# EAGLE design untitled (EAGLE 9.6.2)
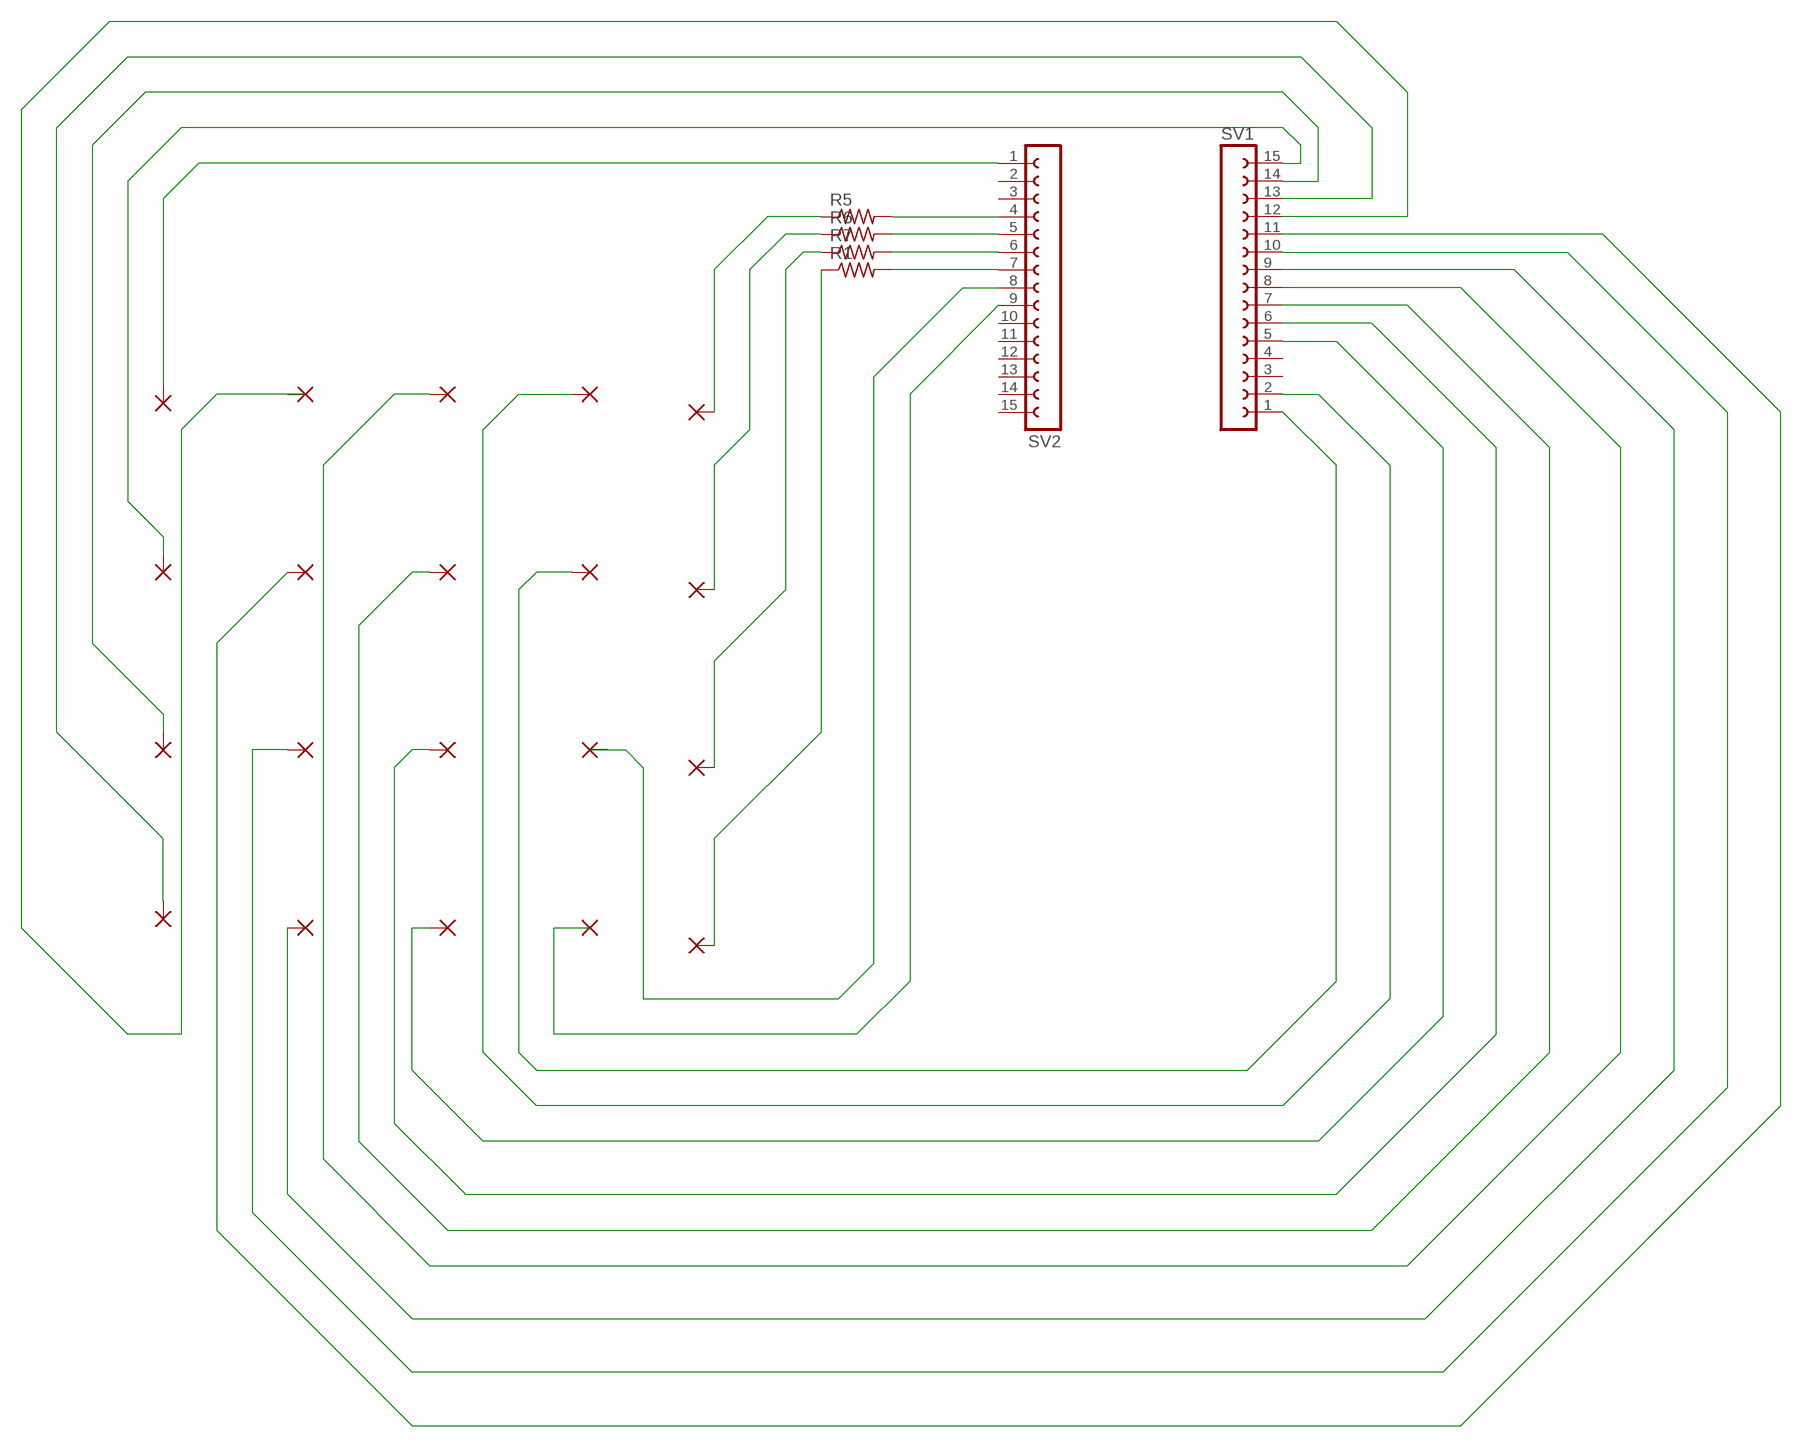
[diagram p0: schematic, sheet 1]

## Parts
PAD1  1,6/0,8  [1,6/0,8]
PAD2  1,6/0,8  [1,6/0,8]
PAD3  1,6/0,8  [1,6/0,8]
PAD4  1,6/0,8  [1,6/0,8]
PAD5  1,6/0,8  [1,6/0,8]
PAD6  1,6/0,8  [1,6/0,8]
PAD7  1,6/0,8  [1,6/0,8]
PAD8  1,6/0,8  [1,6/0,8]
PAD9  1,6/0,8  [1,6/0,8]
PAD10  1,6/0,8  [1,6/0,8]
PAD11  1,6/0,8  [1,6/0,8]
PAD12  1,6/0,8  [1,6/0,8]
PAD13  1,6/0,8  [1,6/0,8]
PAD14  1,6/0,8  [1,6/0,8]
PAD15  1,6/0,8  [1,6/0,8]
PAD16  1,6/0,8  [1,6/0,8]
PAD17  1,6/0,8  [1,6/0,8]
PAD18  1,6/0,8  [1,6/0,8]
PAD19  1,6/0,8  [1,6/0,8]
PAD20  1,6/0,8  [1,6/0,8]
R1  FLIPFLOP-RES  [0805-THM]
R5  FLIPFLOP-RES  [0805-THM]
R6  FLIPFLOP-RES  [0805-THM]
R7  FLIPFLOP-RES  [0805-THM]
SV1  FE15-1  [FE15]
SV2  FE15-1  [FE15]

## Nets
N$1: PAD17.1(P) SV2.1
N$2: PAD19.1(P) SV1.14
N$3: PAD18.1(P) SV1.15
N$4: PAD20.1(P) SV1.13
N$5: PAD16.1(P) SV1.12
N$6: R5.2 SV2.4
N$7: R6.2 SV2.5
N$8: R7.2 SV2.6
N$9: R1.2 SV2.7
N$10: PAD6.1(P) SV1.1
N$11: PAD7.1(P) SV2.8
N$12: PAD8.1(P) SV2.9
N$13: PAD5.1(P) SV1.2
N$14: PAD12.1(P) SV1.5
N$15: PAD9.1(P) SV1.8
N$16: PAD11.1(P) SV1.6
N$17: PAD10.1(P) SV1.7
N$18: PAD15.1(P) SV1.9
N$19: PAD14.1(P) SV1.10
N$20: PAD1.1(P) R5.1
N$21: PAD13.1(P) SV1.11
N$22: PAD2.1(P) R6.1
N$23: PAD3.1(P) R7.1
N$24: PAD4.1(P) R1.1
Unconnected: SV1.3 SV1.4 SV2.2 SV2.3 SV2.10 SV2.11 SV2.12 SV2.13 SV2.14 SV2.15

## Library data of the parts
PAD1-PAD20 = wirepad:1,6/0,8: THROUGH-HOLE PAD
R1 R5-R7 = adafruit:FLIPFLOP-RES: Flip Flop resistor An 0805 resistor inside a standard 1/4W 5% resistor. Makes for easy mods
SV1 SV2 = con-lsta:FE15-1: FEMALE HEADER; OC_FARNELL: unknown; OC_NEWARK: unknown

## Board
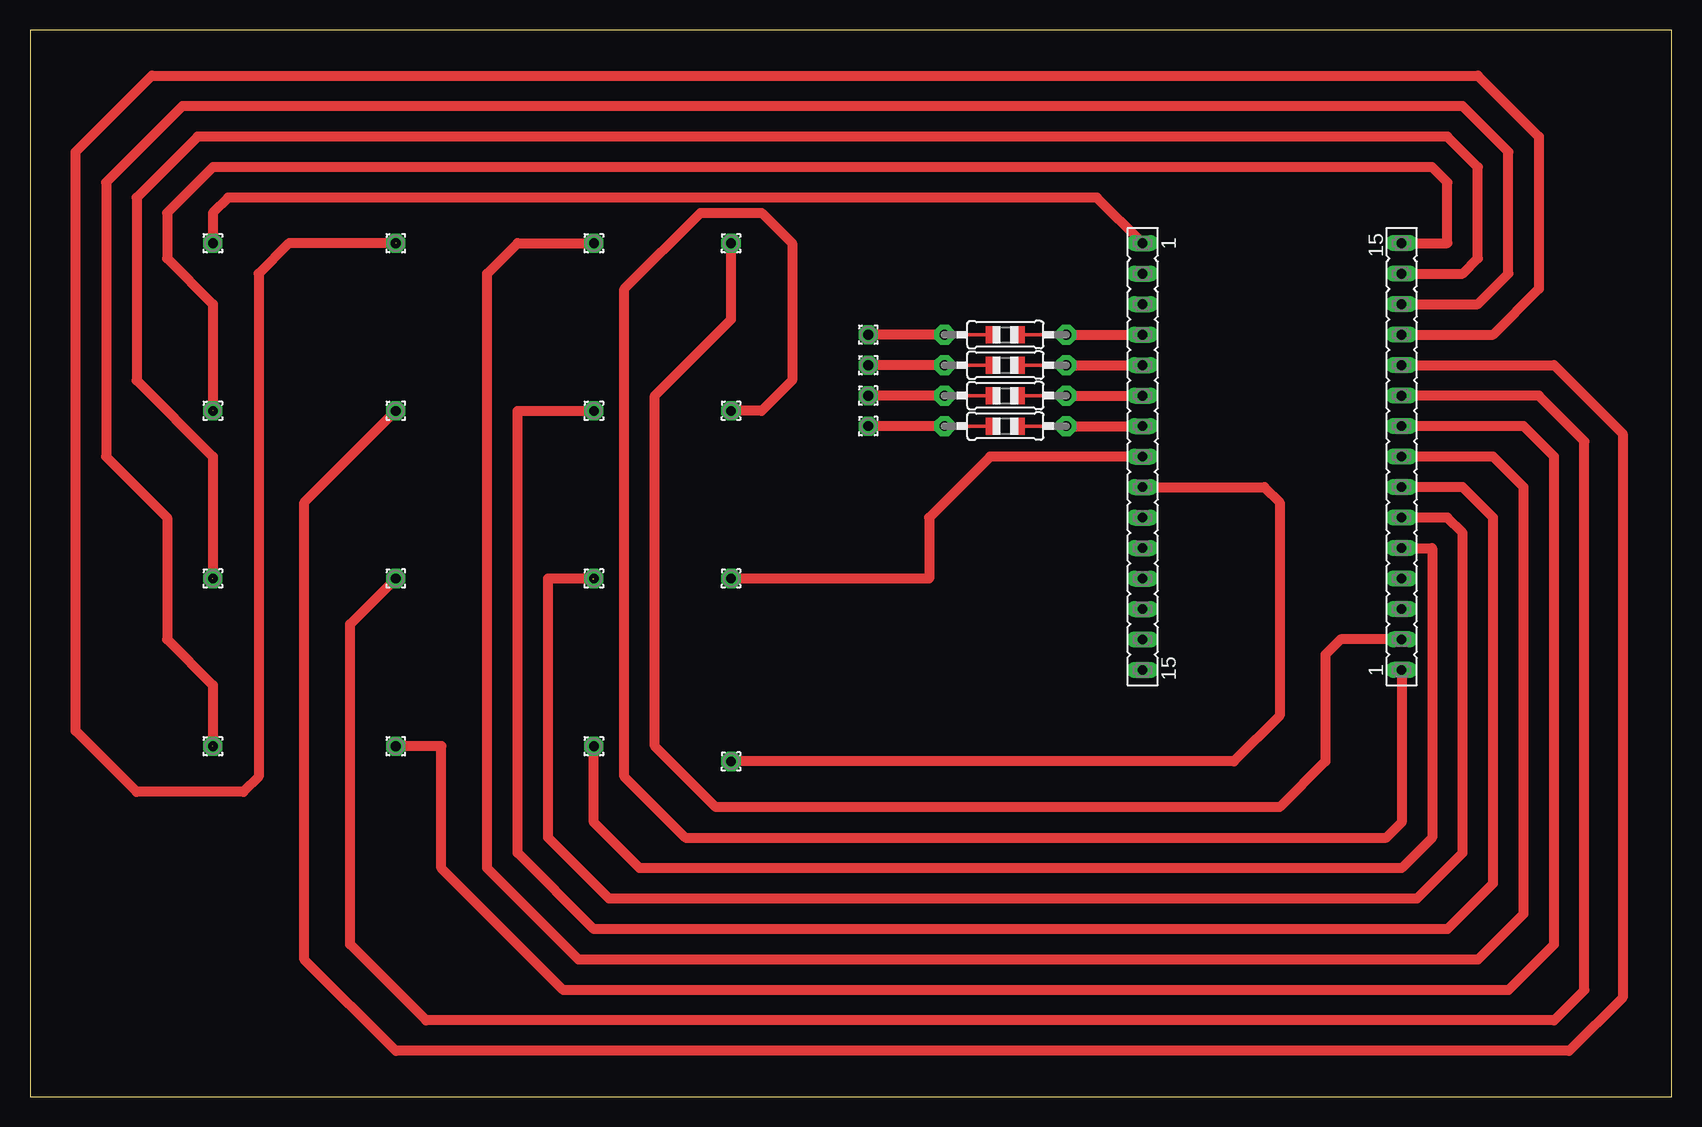
[diagram p1: board, top side]

Size 136.83 x 88.89 mm. Coordinates in mm from the lower left corner, seen from the top.
Outline: 0,0 136.83,0 136.83,88.89 0,88.89 0,0
Copper layers (1*16): Top 0.035mm / dielectric 1.5mm / Bottom 0.035mm
Design rules "default": minimum track width 6mil, minimum drill 0.35mm, track to track 6mil, track to pad 6mil, pad to pad 6mil, via to via 6mil, smd to smd 6mil, copper to edge 40mil, drill to drill 6mil, minimum pad ring 10mil, minimum via ring 8mil, stop-mask expansion 4mil, vias tented up to drill 0mil, thermal gap 10mil

### Footprints (pad centres in the part's own frame; a part is rotated, then mirrored left to right if it is on the bottom)
1,6/0,8 = drill 0.813 pad 1.6 octagon: 1 0,0
0805-THM = drill 0.813 pad 1.676 octagon: 1 -5.08,0; 2 5.08,0
FE15 = drill 0.813 long: 1 -17.78,0; 2 -15.24,0; 3 -12.7,0; 4 -10.16,0; 5 -7.62,0; 6 -5.08,0; 7 -2.54,0; 8 0,0; 9 2.54,0; 10 5.08,0; 11 7.62,0; 12 10.16,0; 13 12.7,0; 14 15.24,0; 15 17.78,0

### Placement (x,y rotation side)
PAD1  69.85,63.5 0 top
PAD2  69.85,60.96 0 top
PAD3  69.85,58.42 0 top
PAD4  69.85,55.88 0 top
PAD5  58.42,71.12 0 top
PAD6  58.42,57.15 0 top
PAD7  58.42,43.18 0 top
PAD8  58.42,27.94 0 top
PAD9  46.99,71.12 0 top
PAD10  46.99,57.15 0 top
PAD11  46.99,43.18 0 top
PAD12  46.99,29.21 0 top
PAD13  30.48,57.15 0 top
PAD14  30.48,43.18 0 top
PAD15  30.48,29.21 0 top
PAD16  30.48,71.12 0 top
PAD17  15.24,71.12 0 top
PAD18  15.24,57.15 0 top
PAD19  15.24,43.18 0 top
PAD20  15.24,29.21 0 top
R1  81.28,55.88 0 top
R5  81.28,63.5 0 top
R6  81.28,60.96 0 top
R7  81.28,58.42 0 top
SV1  114.3,53.34 90 top
SV2  92.71,53.34 270 top

### Tracks (layer width: path | path; a pad name or v marks a point on that pad's centre or on a via)
N$1
  Top 0.813: PAD17.1 15.24,73.66 16.51,74.93 88.9,74.93 SV2.1
N$2  (1 unrouted)
  Top 0.813: SV1.14 119.38,68.58 120.65,69.85 120.65,77.47 118.11,80.01 13.97,80.01 8.89,74.93 8.89,59.69 15.24,53.34 15.24,48.26 15.24,43.21
N$3  (1 unrouted)
  Top 0.813: SV1.15 118.11,71.12 118.11,76.2 116.84,77.47 15.24,77.47 11.43,73.66 11.43,69.85 15.24,66.04 15.24,57.18
N$4  (1 unrouted)
  Top 0.813: SV1.13 120.65,66.04 123.19,68.58 123.19,78.74 119.38,82.55 12.7,82.55 6.35,76.2 6.35,53.34 11.43,48.26 11.43,38.1 15.24,34.29 15.24,29.24
N$5  (1 unrouted)
  Top 0.813: SV1.12 121.92,63.5 125.73,67.31 125.73,80.01 120.65,85.09 10.16,85.09 3.81,78.74 3.81,30.48 8.89,25.4 17.78,25.4 19.05,26.67 19.05,68.58 21.62,71.15 30.48,71.15
N$6
  Top 0.813: R5.2 SV2.4
N$7
  Top 0.813: R6.2 SV2.5
N$8
  Top 0.813: R7.2 SV2.6
N$9
  Top 0.813: R1.2 SV2.7
N$10
  Top 0.813: SV1.1 114.3,22.86 113.03,21.59 54.61,21.59 49.53,26.67 49.53,67.31 55.88,73.66 60.96,73.66 63.5,71.12 63.5,59.69 60.96,57.15 PAD6.1
N$11
  Top 0.813: SV2.8 80.01,53.34 74.93,48.26 74.93,43.18 PAD7.1
N$12
  Top 0.813: SV2.9 102.87,50.8 104.14,49.53 104.14,31.75 100.33,27.94 PAD8.1
N$13
  Top 0.813: 58.51,71.03 PAD5.1 58.42,64.77 52.07,58.42 52.07,29.21 57.15,24.13 104.14,24.13 107.95,27.94 107.95,36.83 109.22,38.1 SV1.2
N$14
  Top 0.813: SV1.5 116.84,45.72 116.84,21.59 114.3,19.05 50.8,19.05 46.99,22.86 PAD12.1
N$15
  Top 0.813: SV1.8 121.92,53.34 124.46,50.8 124.46,15.24 120.65,11.43 45.72,11.43 38.1,19.05 38.1,68.58 40.64,71.12 46.81,71.12 46.9,71.03 PAD9.1
N$16  (1 unrouted)
  Top 0.813: 46.9,43.18 43.18,43.18 43.18,21.59 48.26,16.51 115.57,16.51 119.38,20.32 119.38,46.99 118.11,48.26 SV1.6
N$17
  Top 0.813: SV1.7 119.38,50.8 121.92,48.26 121.92,17.78 118.11,13.97 46.99,13.97 40.64,20.32 40.64,57.15 PAD10.1
N$18
  Top 0.813: SV1.9 124.46,55.88 127,53.34 127,12.7 123.19,8.89 44.45,8.89 34.29,19.05 34.29,29.21 PAD15.1
N$19
  Top 0.813: SV1.10 125.73,58.42 129.54,54.61 129.54,8.89 127,6.35 33.02,6.35 26.67,12.7 26.67,39.37 PAD14.1
N$20
  Top 0.813: R5.1 PAD1.1
N$21
  Top 0.813: SV1.11 127,60.96 132.72,55.24 132.72,8.25 128.27,3.81 30.48,3.81 22.86,11.43 22.86,49.53 PAD13.1
N$22
  Top 0.813: R6.1 PAD2.1
N$23
  Top 0.813: R7.1 PAD3.1
N$24
  Top 0.813: R1.1 PAD4.1